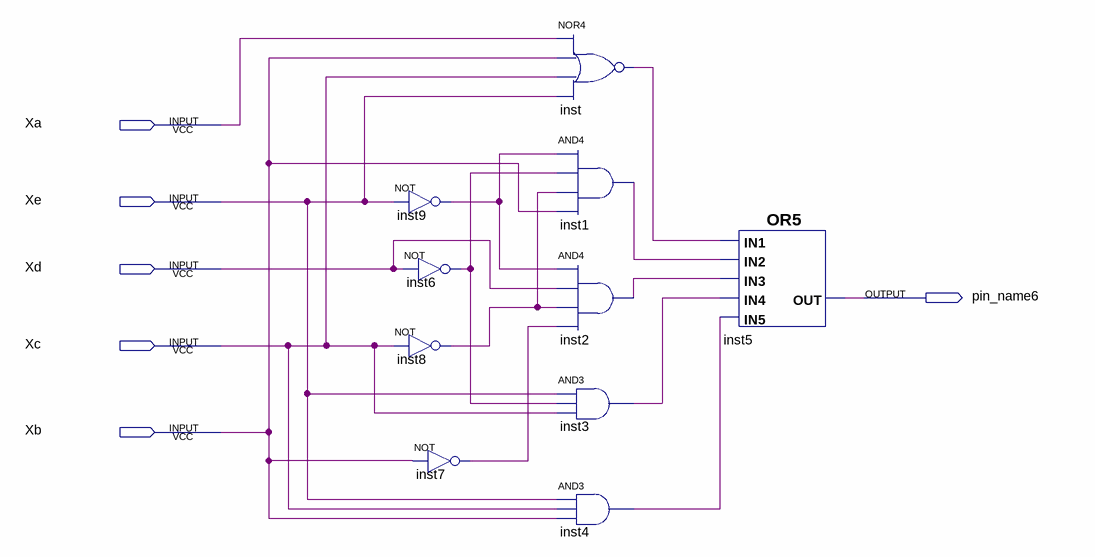
[diagram p0: schematic sheet]
// Quartus schematic Lab02.bdf as structural Verilog: 10 symbols, 6 pins
module Lab02 (
  input  Xa,
  input  Xe,
  input  Xd,
  input  Xc,
  input  Xb,
  output pin_name6
);

  wire inst1_out, inst2_out, inst3_out, inst4_out, inst6_out, inst7_out, inst8_out, inst9_out, inst_out;

  not inst9 (inst9_out, Xe);
  not inst6 (inst6_out, Xd);
  not inst8 (inst8_out, Xc);
  not inst7 (inst7_out, Xb);
  nor inst (inst_out, Xa, Xb, Xc, Xe);
  and inst1 (inst1_out, inst9_out, inst6_out, inst8_out, Xb);
  and inst2 (inst2_out, inst9_out, Xd, inst8_out, inst7_out);
  and inst3 (inst3_out, Xe, inst6_out, Xc);
  and inst4 (inst4_out, Xe, Xc, Xb);
  or inst5 (pin_name6, inst_out, inst1_out, inst2_out, inst3_out, inst4_out);
endmodule
